# Altium project F4baseband.PrjPcb
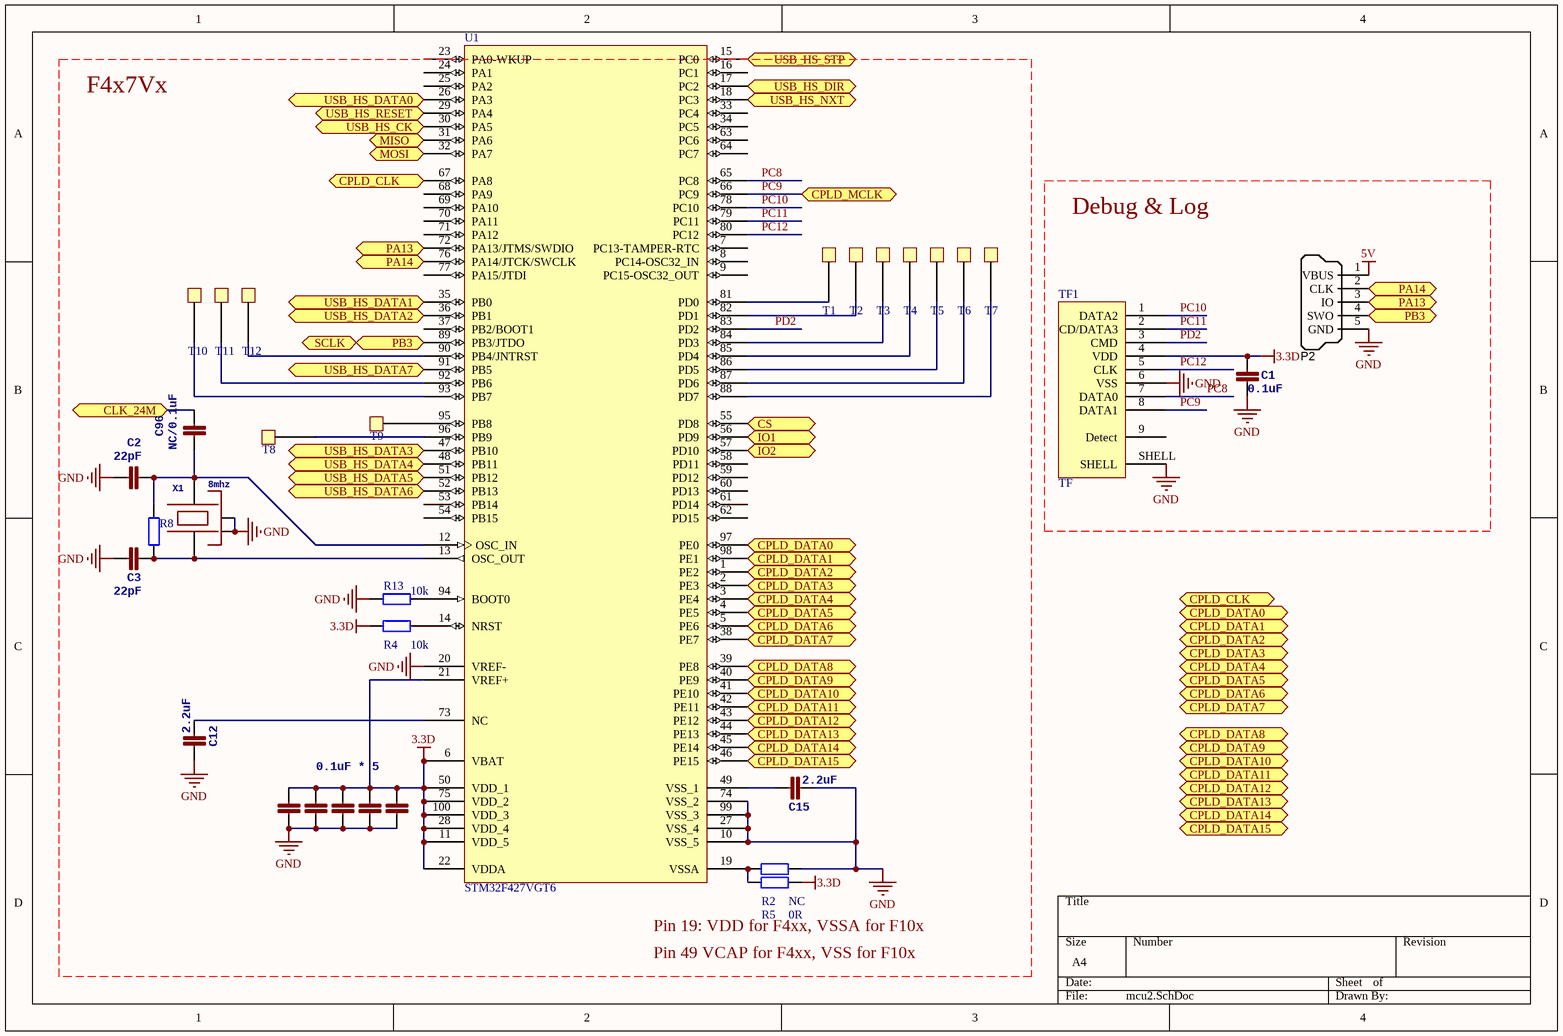
[diagram p0: mcu2.SchDoc]
5 sheets, 212 parts. Net scope: flat (ports and power ports of the same name join across sheets).
Board file: F4baseband.PcbDoc
Sheets:
  mcu2.SchDoc
  CPLD.SchDoc
  power.SchDoc
  ADC.SchDoc
  DAC.SchDoc

## Sheet mcu2.SchDoc
size A4

### Parts
C1  0.1uF  [0402]
C2  22pF  [0402]
C3  22pF  [0402]
C4  0.1uF * 5  [0402]
C5  1n  [0402]  (value not drawn)
C6  1n  [0402]  (value not drawn)
C12  2.2uF  [0603]
C13  1n  [0402]  (value not drawn)
C14  1n  [0402]  (value not drawn)
C15  2.2uF  [0603]
C96  NC/0.1uF  [0402]
P2  SWD_MicroUSB  [MICRO-YZX]  (value not drawn)
R2  0R  [0402]
R4  10k  [0402]
R5  NC  [0402]
R8  (no value)  [0402]
R13  10k  [0402]
T1  TestPad  [TestPad - 1mm]  (value not drawn)
T2  TestPad  [TestPad - 1mm]  (value not drawn)
T3  TestPad  [TestPad - 1mm]  (value not drawn)
T4  TestPad  [TestPad - 1mm]  (value not drawn)
T5  TestPad  [TestPad - 1mm]  (value not drawn)
T6  TestPad  [TestPad - 1mm]  (value not drawn)
T7  TestPad  [TestPad - 1mm]  (value not drawn)
T8  TestPad  [TestPad - 1mm]  (value not drawn)
T9  TestPad  [TestPad - 1mm]  (value not drawn)
T10  TestPad  [TestPad - 1mm]  (value not drawn)
T11  TestPad  [TestPad - 1mm]  (value not drawn)
T12  TestPad  [TestPad - 1mm]  (value not drawn)
TF1  TF  [TF]
U1  STM32F427VGT6  [LQFP100_N]
X1  8mhz  [OSCILLATOR-3.2X2.5]

### Ports
CLK_24M, CPLD_CLK, CPLD_DATA0, CPLD_DATA1, CPLD_DATA2, CPLD_DATA3, CPLD_DATA4, CPLD_DATA5, CPLD_DATA6, CPLD_DATA7, CPLD_DATA8, CPLD_DATA9, CPLD_DATA10, CPLD_DATA11, CPLD_DATA12, CPLD_DATA13, CPLD_DATA14, CPLD_DATA15, CPLD_MCLK, CS, IO1, IO2, MISO, MOSI, PA13, PA14, PB3, SCLK, USB_HS_CK, USB_HS_DATA0, USB_HS_DATA1, USB_HS_DATA2, USB_HS_DATA3, USB_HS_DATA4, USB_HS_DATA5, USB_HS_DATA6, USB_HS_DATA7, USB_HS_DIR, USB_HS_NXT, USB_HS_RESET, USB_HS_STP

### Nets
3.3D: C1.2 C4.2 C5.2 C6.2 C13.2 C14.2 R2.1 R4.2 TF1.4(VDD) U1.6(VBAT) U1.11(VDD_5) U1.21(VREF+) U1.22(VDDA) U1.28(VDD_4) U1.50(VDD_1) U1.75(VDD_2) U1.100(VDD_3)
5V: P2.1(VBUS)
GND: C1.1 C2.2 C3.2 C4.1 C5.1 C6.1 C12.1 C13.1 C14.1 C15.2 P2.5(GND) R5.1 R13.1 TF1.6(VSS) TF1.SHELL U1.10(VSS_5) U1.20(VREF-) U1.27(VSS_4) U1.74(VSS_2) U1.99(VSS_3) X1.2(NC_2) X1.4(NC_4)
PC8: TF1.7(DATA0) U1.65(PC8)
PC9: TF1.8(DATA1) U1.66(PC9) ; port CPLD_MCLK
PC10: TF1.1(DATA2) U1.78(PC10)
PC11: TF1.2(CD/DATA3) U1.79(PC11)
PC12: TF1.5(CLK) U1.80(PC12)
PD2: TF1.3(CMD) U1.83(PD2)
PIN35: U1.97(PE0) ; port CPLD_DATA0
PIN36: U1.98(PE1) ; port CPLD_DATA1
PIN37: U1.1(PE2) ; port CPLD_DATA2
PIN38: U1.2(PE3) ; port CPLD_DATA3
PIN42: U1.67(PA8) ; port CPLD_CLK
PIN43: U1.3(PE4) ; port CPLD_DATA4
PIN44: U1.4(PE5) ; port CPLD_DATA5
PIN45: U1.5(PE6) ; port CPLD_DATA6
PIN46: U1.38(PE7) ; port CPLD_DATA7
PIN47: U1.39(PE8) ; port CPLD_DATA8
PIN48: U1.40(PE9) ; port CPLD_DATA9
PIN49: U1.46(PE15) ; port CPLD_DATA15
PIN50: U1.45(PE14) ; port CPLD_DATA14
PIN51: U1.44(PE13) ; port CPLD_DATA13
PIN52: U1.43(PE12) ; port CPLD_DATA12
PIN53: U1.42(PE11) ; port CPLD_DATA11
PIN54: U1.41(PE10) ; port CPLD_DATA10
PIN58: P2.4(SWO) U1.89(PB3/JTDO) ; port SCLK, port PB3
PIN59: U1.31(PA6) ; port MISO
PIN60: U1.32(PA7) ; port MOSI
PIN61: U1.55(PD8) ; port CS
PIN62: U1.56(PD9) ; port IO1
PIN63: U1.57(PD10) ; port IO2
NetC2_1: C2.1 C96.2 R8.2 U1.12(OSC_IN) X1.3
NetC3_1: C3.1 R8.1 U1.13(OSC_OUT) X1.1
NetC12_2: C12.2 U1.73(NC)
NetC15_1: C15.1 U1.49(VSS_1)
NetC96_1: C96.1 ; port CLK_24M
NetP2_2: P2.2(CLK) U1.76(PA14/JTCK/SWCLK) ; port PA14
NetP2_3: P2.3(IO) U1.72(PA13/JTMS/SWDIO) ; port PA13
NetR2_2: R2.2 R5.2 U1.19(VSSA)
NetR4_1: R4.1 U1.14(NRST)
NetR13_2: R13.2 U1.94(BOOT0)
NetT1_1: T1.1 U1.81(PD0)
NetT2_1: T2.1 U1.82(PD1)
NetT3_1: T3.1 U1.84(PD3)
NetT4_1: T4.1 U1.85(PD4)
NetT5_1: T5.1 U1.86(PD5)
NetT6_1: T6.1 U1.87(PD6)
NetT7_1: T7.1 U1.88(PD7)
NetT8_1: T8.1 U1.96(PB9)
NetT9_1: T9.1 U1.95(PB8)
NetT10_1: T10.1 U1.93(PB7)
NetT11_1: T11.1 U1.92(PB6)
NetT12_1: T12.1 U1.90(PB4/JNTRST)
NetU1_15: U1.15(PC0) ; port USB_HS_STP
NetU1_17: U1.17(PC2) ; port USB_HS_DIR
NetU1_18: U1.18(PC3) ; port USB_HS_NXT
NetU1_26: U1.26(PA3) ; port USB_HS_DATA0
NetU1_29: U1.29(PA4) ; port USB_HS_RESET
NetU1_30: U1.30(PA5) ; port USB_HS_CK
NetU1_35: U1.35(PB0) ; port USB_HS_DATA1
NetU1_36: U1.36(PB1) ; port USB_HS_DATA2
NetU1_47: U1.47(PB10) ; port USB_HS_DATA3
NetU1_48: U1.48(PB11) ; port USB_HS_DATA4
NetU1_51: U1.51(PB12) ; port USB_HS_DATA5
NetU1_52: U1.52(PB13) ; port USB_HS_DATA6
NetU1_91: U1.91(PB5) ; port USB_HS_DATA7

Not connected (* = marked no-connect by the designer): TF1 9(Detect); U1 7(PC13-TAMPER-RTC) 8(PC14-OSC32_IN) 9(PC15-OSC32_OUT) 16(PC1) 23(PA0-WKUP) 24(PA1) 25(PA2) 33(PC4) 34(PC5) 37(PB2/BOOT1) 53(PB14) 54(PB15) 58(PD11) 59(PD12) 60(PD13) 61(PD14) 62(PD15) 63(PC6) 64(PC7) 68(PA9) 69(PA10) 70(PA11) 71(PA12) 77(PA15/JTDI)

### Notes on the sheet
- F4x7Vx
- Debug & Log
- Pin 19: VDD for F4xx, VSSA for F10x
- Pin 49 VCAP for F4xx, VSS for F10x

### Library data of the parts
C1-C6 C12-C15 C96 = CAP0402-CAP: <b>Capacitor</b> / Standard 0603 ceramic capacitor, and 0.1" leaded capacitor.; PARTNO: CC0402ZRY5V7BB104
P2 = SWD_MicroUSB: Connector SMD USB Micro Type B middle mount; Manufacturer 1: Molex Inc; SCDType: undef; Package / Case: SMD; Supplier 1: Digi-Key; Supplier Part Number 1: WM17142CT-ND
R2 R4 R5 R8 R13 = Res2: Resistor; Value: 0Ohm; Published: 8-Jun-2000; LatestRevisionDate: 17-Jul-2002; LatestRevisionNote: Re-released for DXP Platform.; PackageReference: AXIAL-0.4; Publisher: Altium Limited; PackageDescription: Axial Device, Thru-Hole; 2 Leads; 0.4 in Pin Spacing
U1 = STM32F103VBT6: STM32 ARM-based 32-bit MCU with 64 Kbytes Flash, 100-pin LQFP, Industrial Temperature; Published: *; DatasheetVersion: *; PackageVersion: *; PackageReference: *; Publisher: *; PackageDescription: *; ComponentLink1Description: *; ComponentLink1URL: *; ComponentLink2Description: *; ComponentLink2URL: *
X1 = OSCILLATOR-3.2X2.5: Crystal Oscillator in 3.2x2.5 SMD

## Sheet CPLD.SchDoc
size A4
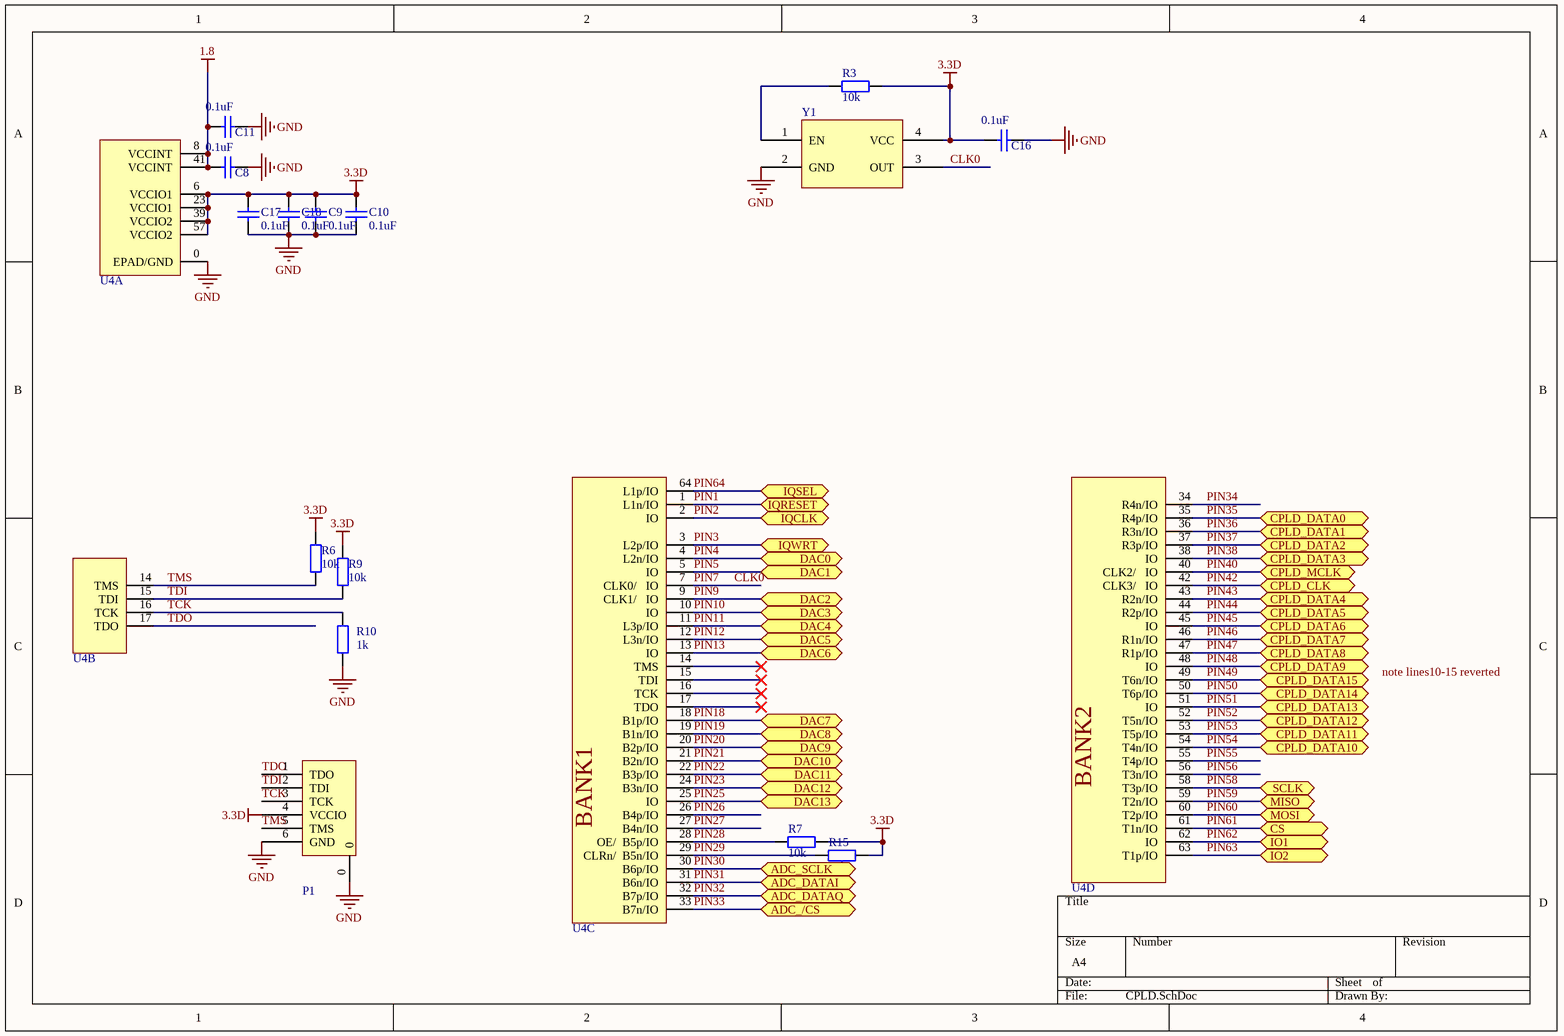
[diagram p1: CPLD.SchDoc]

### Parts
C8  0.1uF  [0402]
C9  0.1uF  [0402]
C10  0.1uF  [0402]
C11  0.1uF  [0402]
C16  0.1uF  [0402]
C17  0.1uF  [0402]
C18  0.1uF  [0402]
P1  JTAG-6P  [GH1.25-6]  (value not drawn)
R3  10k  [0402]
R6  10k  [0402]
R7  10k  [0402]
R9  10k  [0402]
R10  1k  [0402]
R15  10k  [0402]
U4  5M160ZE64  [5M160ZE64]  (value not drawn)  (parts A,B,C,D of 4)
Y1  OSC_50M  [TXC_7Q]  (value not drawn)

### Ports
ADC_/CS, ADC_DATAI, ADC_DATAQ, ADC_SCLK, CPLD_CLK, CPLD_DATA0, CPLD_DATA1, CPLD_DATA2, CPLD_DATA3, CPLD_DATA4, CPLD_DATA5, CPLD_DATA6, CPLD_DATA7, CPLD_DATA8, CPLD_DATA9, CPLD_DATA10, CPLD_DATA11, CPLD_DATA12, CPLD_DATA13, CPLD_DATA14, CPLD_DATA15, CPLD_MCLK, CS, DAC0, DAC1, DAC2, DAC3, DAC4, DAC5, DAC6, DAC7, DAC8, DAC9, DAC10, DAC11, DAC12, DAC13, IO1, IO2, IQCLK, IQRESET, IQSEL, IQWRT, MISO, MOSI, SCLK

### Nets
1.8: C8.2 C11.2 U4.8(VCCINT) U4.41(VCCINT)
3.3D: C9.2 C10.2 C16.2 C17.2 C18.2 P1.4(VCCIO) R3.2 R6.2 R7.2 R9.2 R15.2 U4.6(VCCIO1) U4.23(VCCIO1) U4.39(VCCIO2) U4.57(VCCIO2) Y1.4(VCC)
GND: C8.1 C9.1 C10.1 C11.1 C16.1 C17.1 C18.1 P1.0 P1.6(GND) R10.1 U4.0(EPAD/GND) Y1.2(GND)
CLK0: U4.7(CLK0/___IO) Y1.3(OUT)  [also labelled PIN7]
PIN1: U4.1(L1n/IO) ; port IQRESET
PIN2: U4.2(IO) ; port IQCLK
PIN3: U4.3(L2p/IO) ; port IQWRT
PIN4: U4.4(L2n/IO) ; port DAC0
PIN5: U4.5(IO) ; port DAC1
PIN9: U4.9(CLK1/___IO) ; port DAC2
PIN10: U4.10(IO) ; port DAC3
PIN11: U4.11(L3p/IO) ; port DAC4
PIN12: U4.12(L3n/IO) ; port DAC5
PIN13: U4.13(IO) ; port DAC6
PIN18: U4.18(B1p/IO) ; port DAC7
PIN19: U4.19(B1n/IO) ; port DAC8
PIN20: U4.20(B2p/IO) ; port DAC9
PIN21: U4.21(B2n/IO) ; port DAC10
PIN22: U4.22(B3p/IO) ; port DAC11
PIN23: U4.24(B3n/IO) ; port DAC12
PIN25: U4.25(IO) ; port DAC13
PIN26: U4.26(B4p/IO)
PIN27: U4.27(B4n/IO)
PIN28: R7.1 U4.28(OE/__B5p/IO)
PIN29: R15.1 U4.29(CLRn/__B5n/IO)
PIN30: U4.30(B6p/IO) ; port ADC_SCLK
PIN31: U4.31(B6n/IO) ; port ADC_DATAI
PIN32: U4.32(B7p/IO) ; port ADC_DATAQ
PIN33: U4.33(B7n/IO) ; port ADC_/CS
PIN34: U4.34(R4n/IO)
PIN35: U4.35(R4p/IO) ; port CPLD_DATA0
PIN36: U4.36(R3n/IO) ; port CPLD_DATA1
PIN37: U4.37(R3p/IO) ; port CPLD_DATA2
PIN38: U4.38(IO) ; port CPLD_DATA3
PIN40: U4.40(CLK2/___IO) ; port CPLD_MCLK  [project net PC9]
PIN42: U4.42(CLK3/___IO) ; port CPLD_CLK
PIN43: U4.43(R2n/IO) ; port CPLD_DATA4
PIN44: U4.44(R2p/IO) ; port CPLD_DATA5
PIN45: U4.45(IO) ; port CPLD_DATA6
PIN46: U4.46(R1n/IO) ; port CPLD_DATA7
PIN47: U4.47(R1p/IO) ; port CPLD_DATA8
PIN48: U4.48(IO) ; port CPLD_DATA9
PIN49: U4.49(T6n/IO) ; port CPLD_DATA15
PIN50: U4.50(T6p/IO) ; port CPLD_DATA14
PIN51: U4.51(IO) ; port CPLD_DATA13
PIN52: U4.52(T5n/IO) ; port CPLD_DATA12
PIN53: U4.53(T5p/IO) ; port CPLD_DATA11
PIN54: U4.54(T4n/IO) ; port CPLD_DATA10
PIN55: U4.55(T4p/IO)
PIN56: U4.56(T3n/IO)
PIN58: U4.58(T3p/IO) ; port SCLK
PIN59: U4.59(T2n/IO) ; port MISO
PIN60: U4.60(T2p/IO) ; port MOSI
PIN61: U4.61(T1n/IO) ; port CS
PIN62: U4.62(IO) ; port IO1
PIN63: U4.63(T1p/IO) ; port IO2
PIN64: U4.64(L1p/IO) ; port IQSEL
TCK: P1.3(TCK) R10.2 U4.16(TCK)
TDI: P1.2(TDI) R9.1 U4.15(TDI)
TDO: P1.1(TDO) U4.17(TDO)
TMS: P1.5(TMS) R6.1 U4.14(TMS)
NetR3_1: R3.1 Y1.1(EN)

### Notes on the sheet
- Labels drawn without touching a wire or pin: note lines10-15 reverted
- (in symbol 5M160ZE64, part C) BANK1
- (in symbol 5M160ZE64, part D) BANK2

### Library data of the parts
C8-C11 C16-C18 = Cap: Capacitor; Published: 8-Jun-2000; LatestRevisionDate: 17-Jul-2002; LatestRevisionNote: Re-released for DXP Platform.; PackageReference: RAD-0.3; Publisher: Altium Limited; PackageDescription: Radial Cap, Thru-Hole; 2 Leads; 0.3 in Pin Spacing
R3 R6 R7 R9 R10 R15 = Res2: Resistor; Published: 8-Jun-2000; LatestRevisionDate: 17-Jul-2002; LatestRevisionNote: Re-released for DXP Platform.; PackageReference: AXIAL-0.4; Publisher: Altium Limited; PackageDescription: Axial Device, Thru-Hole; 2 Leads; 0.4 in Pin Spacing

## Sheet power.SchDoc
size A4
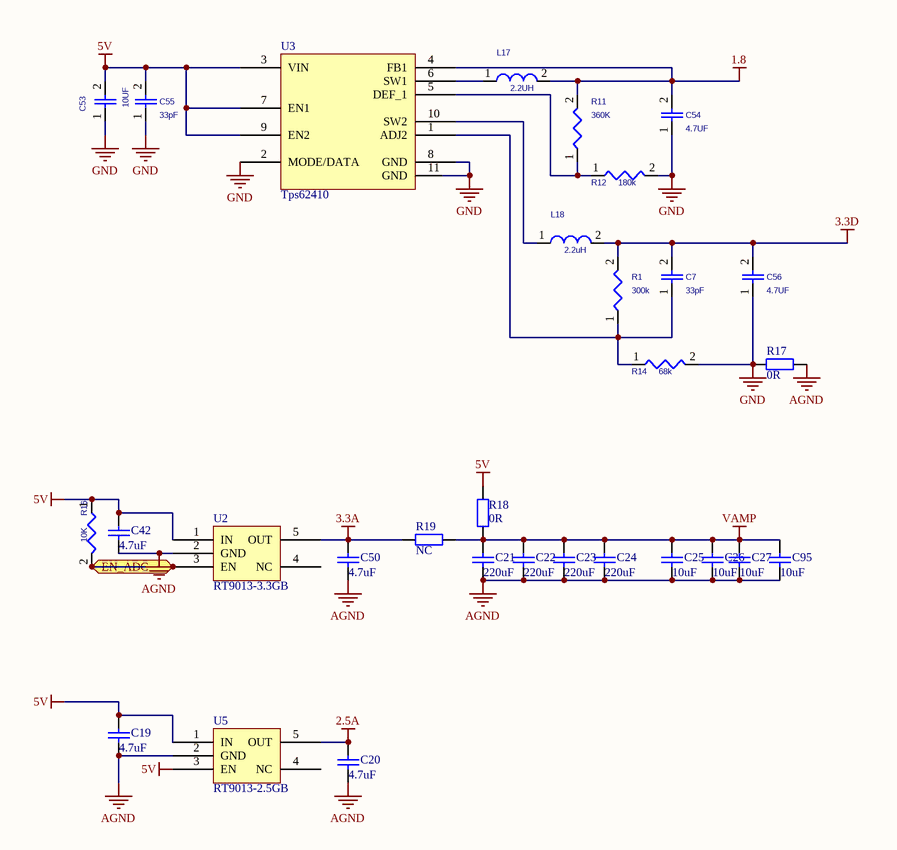
[diagram p2: power.SchDoc]

### Parts
C7  33pF  [0402]
C19  4.7uF  [0603]
C20  4.7uF  [0603]
C21  220uF  [1210]
C22  220uF  [1210]
C23  220uF  [1210]
C24  220uF  [1210]
C25  10uF  [0805]
C26  10uF  [0805]
C27  10uF  [0805]
C42  4.7uF  [0603]
C50  4.7uF  [0603]
C53  10UF  [0805]
C54  4.7UF  [0805]
C55  33pF  [0603]
C56  4.7UF  [0805]
C95  10uF  [0805]
L17  2.2UH  [0806]
L18  2.2uH  [0806]
R1  300k  [0402]
R11  360K  [0402]
R12  180k  [0402]
R14  68k  [0402]
R16  10K  [0402]
R17  0R  [0603]
R18  0R  [0603]
R19  NC  [0603]
U2  RT9013-3.3GB  [SOT23-5]
U3  Tps62410  [DFN-10P-3X3]
U5  RT9013-2.5GB  [SOT23-5]

### Ports
EN_ADC

### Nets
1.8: C54.2 L17.2 R11.2 U3.4(FB1)
2.5A: C20.2 U5.5(OUT)
3.3A: C50.2 R19.1 U2.5(OUT)
3.3D: C7.2 C56.2 L18.2 R1.2
5V: C19.2 C42.2 C53.2 C55.2 R16.1 R18.2 U2.1(IN) U3.3(VIN) U3.7(EN1) U3.9(EN2) U5.1(IN) U5.3(EN)
AGND: C19.1 C20.1 C21.1 C22.1 C23.1 C24.1 C25.1 C26.1 C27.1 C42.1 C50.1 C95.1 R17.1 U2.2(GND) U5.2(GND)
GND: C53.1 C54.1 C55.1 C56.1 R12.2 R14.2 R17.2 U3.2(MODE/DATA) U3.8(GND) U3.11(GND)
VAMP: C21.2 C22.2 C23.2 C24.2 C25.2 C26.2 C27.2 C95.2 R18.1 R19.2
NetC7_1: C7.1 R1.1 R14.1 U3.1(ADJ2)
NetL17_1: L17.1 U3.6(SW1)
NetL18_1: L18.1 U3.10(SW2)
NetR11_1: R11.1 R12.1 U3.5(DEF_1)
NetR16_2: R16.2 U2.3(EN) ; port EN_ADC

Not connected (* = marked no-connect by the designer): U2 4(NC); U5 4(NC)

### Library data of the parts
C7 = CAP/0402: 1st Part Field: 0402
C19-C27 C42 C50 C95 = Cap: Capacitor; Published: 8-Jun-2000; LatestRevisionDate: 17-Jul-2002; LatestRevisionNote: Re-released for DXP Platform.; PackageReference: RAD-0.3; Publisher: Altium Limited; PackageDescription: Radial Cap, Thru-Hole; 2 Leads; 0.3 in Pin Spacing
C53-C56 = CAP/0402: 1st Part Field: 0402
L17 L18 = L/2.5*2.0
R1 R11 R12 R14 R16 = RES/0402_3
R17-R19 = Res2: Resistor; Published: 8-Jun-2000; LatestRevisionDate: 17-Jul-2002; LatestRevisionNote: Re-released for DXP Platform.; PackageReference: AXIAL-0.4; Publisher: Altium Limited; PackageDescription: Axial Device, Thru-Hole; 2 Leads; 0.4 in Pin Spacing
U2 U5 = LP5907

## Sheet ADC.SchDoc
size A4
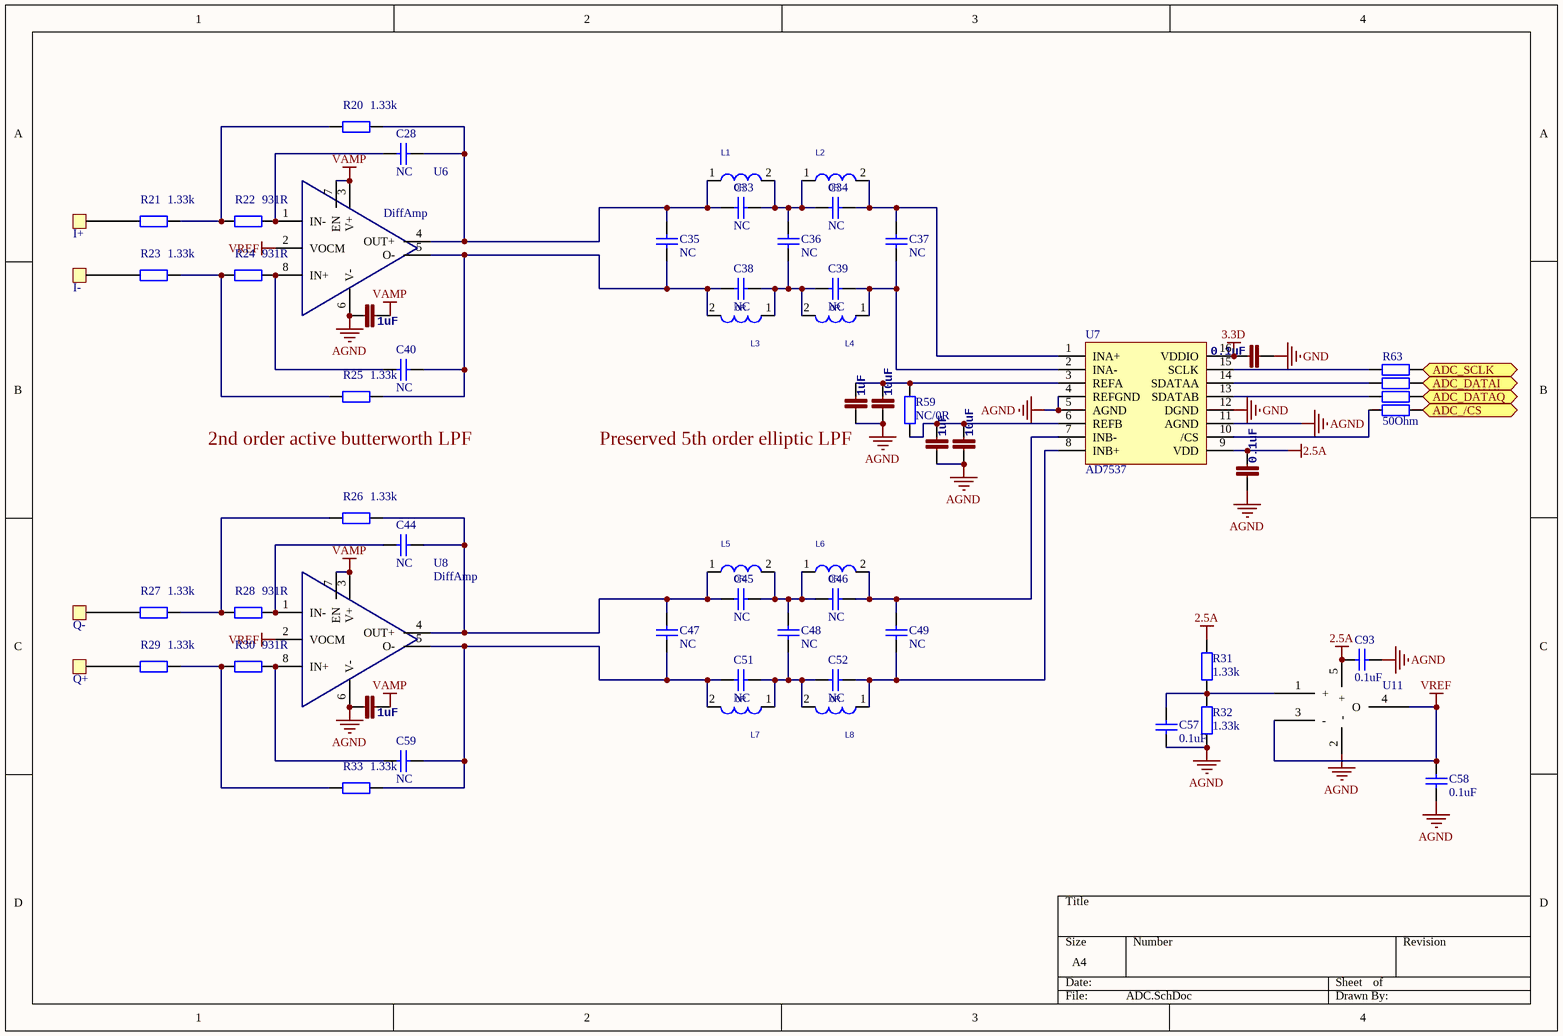
[diagram p3: ADC.SchDoc]

### Parts
C28  NC  [0402]
C29  0.1uF  [0402]
C30  0.1uF  [0603]
C31  10uF  [0603]
C32  1uF  [0805]
C33  NC  [0402]
C34  NC  [0402]
C35  NC  [0402]
C36  NC  [0402]
C37  NC  [0402]
C38  NC  [0402]
C39  NC  [0402]
C40  NC  [0402]
C41  1uF  [0603]
C43  10uF  [0805]
C44  NC  [0402]
C45  NC  [0402]
C46  NC  [0402]
C47  NC  [0402]
C48  NC  [0402]
C49  NC  [0402]
C51  NC  [0402]
C52  NC  [0402]
C57  0.1uF  [0402]
C58  0.1uF  [0402]
C59  NC  [0402]
C89  1uF  [0603]
C90  1uF  [0603]
C93  0.1uF  [0402]
I+  TestPad  [TestPad - 1mm]  (value not drawn)
I-  TestPad  [TestPad - 1mm]  (value not drawn)
L1  0R  [0402]
L2  0R  [0402]
L3  0R  [0402]
L4  0R  [0402]
L5  0R  [0402]
L6  0R  [0402]
L7  0R  [0402]
L8  0R  [0402]
Q+  TestPad  [TestPad - 1mm]  (value not drawn)
Q-  TestPad  [TestPad - 1mm]  (value not drawn)
R20  1.33k  [0402]
R21  1.33k  [0402]
R22  931R  [0402]
R23  1.33k  [0402]
R24  931R  [0402]
R25  1.33k  [0402]
R26  1.33k  [0402]
R27  1.33k  [0402]
R28  931R  [0402]
R29  1.33k  [0402]
R30  931R  [0402]
R31  1.33k  [0402]
R32  1.33k  [0402]
R33  1.33k  [0402]
R59  NC/0R  [0402]
R63  value 50Ohm  [0402X4]  (hidden comment: Res*4)
U6  DiffAmp  [MSOP8/VSSOP8]
U7  AD7537  [AD7357]
U8  DiffAmp  [MSOP8/VSSOP8]
U11  OP-SOT23  [SOT23-5]  (value not drawn)

### Ports
ADC_/CS, ADC_DATAI, ADC_DATAQ, ADC_SCLK

### Nets
2.5A: C30.1 C93.1 R31.1 U7.9(VDD) U11.5(+)
3.3D: C29.1 U7.16(VDDIO)
AGND: C30.2 C31.2 C32.2 C41.2 C43.2 C57.2 C58.2 C89.2 C90.2 C93.2 R32.2 U6.6(V-) U7.4(REFGND) U7.5(AGND) U7.11(AGND) U8.6(V-) U11.2(-)
GND: C29.2 U7.12(DGND)
VAMP: C89.1 C90.1 U6.3(V+) U6.7(EN) U8.3(V+) U8.7(EN)
VREF: C58.1 U6.2(VOCM) U8.2(VOCM) U11.3(-) U11.4(O)
PIN30: R63.4 ; port ADC_SCLK
PIN31: R63.3 ; port ADC_DATAI
PIN32: R63.2 ; port ADC_DATAQ
PIN33: R63.1 ; port ADC_/CS
NetC28_1: C28.1 C33.2 C35.2 L1.1 R20.1 U6.4(OUT+)
NetC28_2: C28.2 R22.1 U6.1(IN-)
NetC31_1: C31.1 C32.1 R59.1 U7.6(REFB)
NetC33_1: C33.1 C34.2 C36.2 L1.2 L2.1
NetC34_1: C34.1 C37.2 L2.2 U7.1(INA+)
NetC35_1: C35.1 C38.1 C40.1 L3.2 R25.1 U6.5(O-)
NetC36_1: C36.1 C38.2 C39.1 L3.1 L4.2
NetC37_1: C37.1 C39.2 L4.1 U7.2(INA-)
NetC40_2: C40.2 R24.1 U6.8(IN+)
NetC41_1: C41.1 C43.1 R59.2 U7.3(REFA)
NetC44_1: C44.1 C45.2 C47.2 L5.1 R26.1 U8.4(OUT+)
NetC44_2: C44.2 R28.1 U8.1(IN-)
NetC45_1: C45.1 C46.2 C48.2 L5.2 L6.1
NetC46_1: C46.1 C49.2 L6.2 U7.7(INB-)
NetC47_1: C47.1 C51.1 C59.1 L7.2 R33.1 U8.5(O-)
NetC48_1: C48.1 C51.2 C52.1 L7.1 L8.2
NetC49_1: C49.1 C52.2 L8.1 U7.8(INB+)
NetC57_1: C57.1 R31.2 R32.1 U11.1(+)
NetC59_2: C59.2 R30.1 U8.8(IN+)
NetI+_1: I+.1 R21.2
NetI-_1: I-.1 R23.2
NetQ+_1: Q+.1 R29.2
NetQ-_1: Q-.1 R27.2
NetR20_2: R20.2 R21.1 R22.2
NetR23_1: R23.1 R24.2 R25.2
NetR26_2: R26.2 R27.1 R28.2
NetR29_1: R29.1 R30.2 R33.2
NetR63_5: R63.5 U7.15(SCLK)
NetR63_6: R63.6 U7.14(SDATAA)
NetR63_7: R63.7 U7.13(SDATAB)
NetR63_8: R63.8 U7.10(/CS)

### Notes on the sheet
- (near R25) 2nd order active butterworth LPF
- (near R59) Preserved 5th order elliptic LPF

### Library data of the parts
C28 C33-C40 C44-C49 C51 C52 C57-C59 C93 = Cap: Capacitor; Published: 8-Jun-2000; LatestRevisionDate: 17-Jul-2002; LatestRevisionNote: Re-released for DXP Platform.; PackageReference: RAD-0.3; Publisher: Altium Limited; PackageDescription: Radial Cap, Thru-Hole; 2 Leads; 0.3 in Pin Spacing
C29-C32 C41 C43 C89 C90 = CAP0402-CAP: as C1 on sheet mcu2
L1-L8 = L/2.5*2.0
R20-R33 R59 = Res2: Resistor; Value: 0Ohm; Published: 8-Jun-2000; LatestRevisionDate: 17-Jul-2002; LatestRevisionNote: Re-released for DXP Platform.; PackageReference: AXIAL-0.4; Publisher: Altium Limited; PackageDescription: Axial Device, Thru-Hole; 2 Leads; 0.4 in Pin Spacing
R63 = Res*4: Resistor; Published: 8-Jun-2000; LatestRevisionDate: 17-Jul-2002; LatestRevisionNote: Re-released for DXP Platform.; PackageReference: AXIAL-0.4; Publisher: Altium Limited; PackageDescription: Axial Device, Thru-Hole; 2 Leads; 0.4 in Pin Spacing

## Sheet DAC.SchDoc
size A4
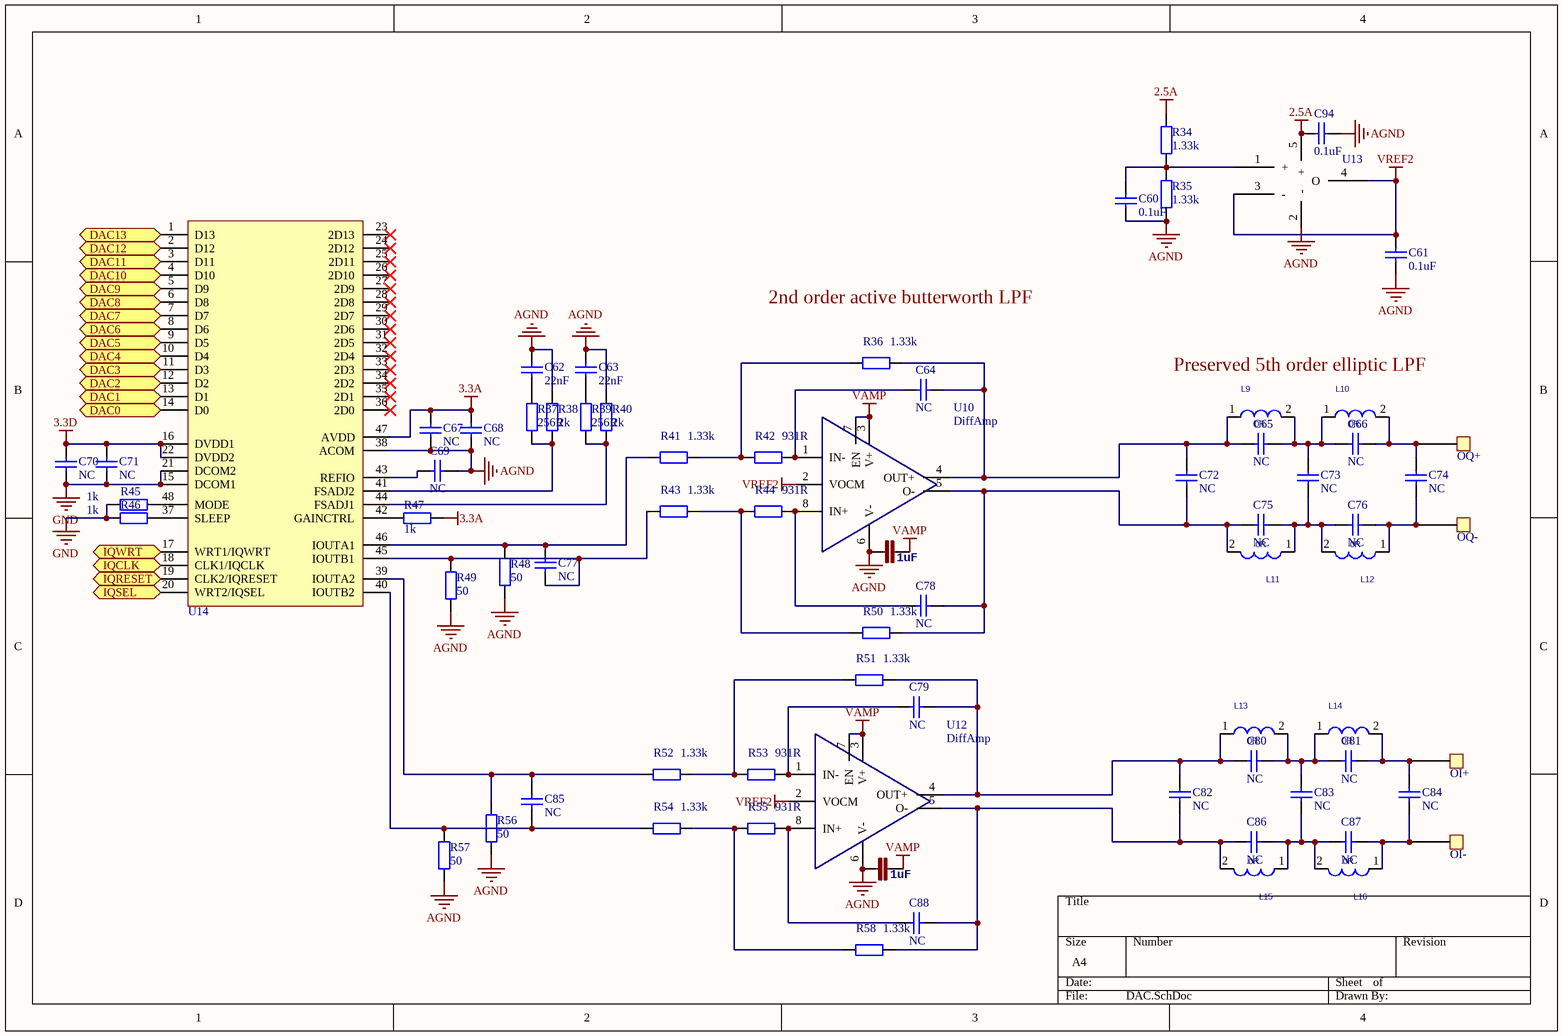
[diagram p4: DAC.SchDoc]

### Parts
C60  0.1uF  [0402]
C61  0.1uF  [0402]
C62  22nF  [0402]
C63  22nF  [0402]
C64  NC  [0402]
C65  NC  [0402]
C66  NC  [0402]
C67  NC  [0603]
C68  NC  [0402]
C69  NC  [0603]
C70  NC  [0402]
C71  NC  [0402]
C72  NC  [0402]
C73  NC  [0402]
C74  NC  [0402]
C75  NC  [0402]
C76  NC  [0402]
C77  NC  [0402]
C78  NC  [0402]
C79  NC  [0402]
C80  NC  [0402]
C81  NC  [0402]
C82  NC  [0402]
C83  NC  [0402]
C84  NC  [0402]
C85  NC  [0402]
C86  NC  [0402]
C87  NC  [0402]
C88  NC  [0402]
C91  1uF  [0603]
C92  1uF  [0603]
C94  0.1uF  [0402]
L9  0R  [0402]
L10  0R  [0402]
L11  0R  [0402]
L12  0R  [0402]
L13  0R  [0402]
L14  0R  [0402]
L15  0R  [0402]
L16  0R  [0402]
OI+  TestPad  [TestPad - 1mm]  (value not drawn)
OI-  TestPad  [TestPad - 1mm]  (value not drawn)
OQ+  TestPad  [TestPad - 1mm]  (value not drawn)
OQ-  TestPad  [TestPad - 1mm]  (value not drawn)
R34  1.33k  [0402]
R35  1.33k  [0402]
R36  1.33k  [0402]
R37  256R  [0402]
R38  2k  [0402]
R39  256R  [0402]
R40  2k  [0402]
R41  1.33k  [0402]
R42  931R  [0402]
R43  1.33k  [0402]
R44  931R  [0402]
R45  1k  [0402]
R46  1k  [0402]
R47  1k  [0402]
R48  50  [0402]
R49  50  [0402]
R50  1.33k  [0402]
R51  1.33k  [0402]
R52  1.33k  [0402]
R53  931R  [0402]
R54  1.33k  [0402]
R55  931R  [0402]
R56  50  [0402]
R57  50  [0402]
R58  1.33k  [0402]
U10  DiffAmp  [MSOP8/VSSOP8]
U12  DiffAmp  [MSOP8/VSSOP8]
U13  OP-SOT23  [SOT23-5]  (value not drawn)
U14  AD9767  [AD9767]  (value not drawn)

### Ports
DAC0, DAC1, DAC2, DAC3, DAC4, DAC5, DAC6, DAC7, DAC8, DAC9, DAC10, DAC11, DAC12, DAC13, IQCLK, IQRESET, IQSEL, IQWRT

### Nets
2.5A: C94.1 R34.1 U13.5(+)
3.3A: C67.1 C68.1 R47.2 U14.47(AVDD)
3.3D: C70.1 C71.1 U14.16(DVDD1) U14.22(DVDD2)
AGND: C60.2 C61.2 C62.1 C63.1 C67.2 C68.2 C69.1 C91.2 C92.2 C94.2 R35.2 R38.2 R40.2 R48.1 R49.2 R56.1 R57.2 U10.6(V-) U12.6(V-) U13.2(-) U14.38(ACOM)
GND: C70.2 C71.2 R45.2 R46.2 U14.15(DCOM1) U14.21(DCOM2)
VAMP: C91.1 C92.1 U10.3(V+) U10.7(EN) U12.3(V+) U12.7(EN)
VREF2: C61.1 U10.2(VOCM) U12.2(VOCM) U13.3(-) U13.4(O)
PIN1: U14.19(CLK2/IQRESET) ; port IQRESET
PIN2: U14.18(CLK1/IQCLK) ; port IQCLK
PIN3: U14.17(WRT1/IQWRT) ; port IQWRT
PIN4: U14.14(D0) ; port DAC0
PIN5: U14.13(D1) ; port DAC1
PIN9: U14.12(D2) ; port DAC2
PIN10: U14.11(D3) ; port DAC3
PIN11: U14.10(D4) ; port DAC4
PIN12: U14.9(D5) ; port DAC5
PIN13: U14.8(D6) ; port DAC6
PIN18: U14.7(D7) ; port DAC7
PIN19: U14.6(D8) ; port DAC8
PIN20: U14.5(D9) ; port DAC9
PIN21: U14.4(D10) ; port DAC10
PIN22: U14.3(D11) ; port DAC11
PIN23: U14.2(D12) ; port DAC12
PIN25: U14.1(D13) ; port DAC13
PIN64: U14.20(WRT2/IQSEL) ; port IQSEL
NetC60_1: C60.1 R34.2 R35.1 U13.1(+)
NetC62_2: C62.2 R37.2
NetC63_2: C63.2 R39.2
NetC64_1: C64.1 C65.2 C72.2 L9.1 R36.1 U10.4(OUT+)
NetC64_2: C64.2 R42.1 U10.1(IN-)
NetC65_1: C65.1 C66.2 C73.2 L9.2 L10.1
NetC66_1: C66.1 C74.2 L10.2 OQ+.1
NetC69_2: C69.2 U14.43(REFIO)
NetC72_1: C72.1 C75.1 C78.1 L11.2 R50.1 U10.5(O-)
NetC73_1: C73.1 C75.2 C76.1 L11.1 L12.2
NetC74_1: C74.1 C76.2 L12.1 OQ-.1
NetC77_1: C77.1 R41.2 R48.2 U14.46(IOUTA1)
NetC77_2: C77.2 R43.2 R49.1 U14.45(IOUTB1)
NetC78_2: C78.2 R44.1 U10.8(IN+)
NetC79_1: C79.1 C80.2 C82.2 L13.1 R51.1 U12.4(OUT+)
NetC79_2: C79.2 R53.1 U12.1(IN-)
NetC80_1: C80.1 C81.2 C83.2 L13.2 L14.1
NetC81_1: C81.1 C84.2 L14.2 OI+.1
NetC82_1: C82.1 C86.1 C88.1 L15.2 R58.1 U12.5(O-)
NetC83_1: C83.1 C86.2 C87.1 L15.1 L16.2
NetC84_1: C84.1 C87.2 L16.1 OI-.1
NetC85_1: C85.1 R52.2 R56.2 U14.39(IOUTA2)
NetC85_2: C85.2 R54.2 R57.1 U14.40(IOUTB2)
NetC88_2: C88.2 R55.1 U12.8(IN+)
NetR36_2: R36.2 R41.1 R42.2
NetR37_1: R37.1 R38.1 U14.41(FSADJ2)
NetR39_1: R39.1 R40.1 U14.44(FSADJ1)
NetR43_1: R43.1 R44.2 R50.2
NetR45_1: R45.1 U14.48(MODE)
NetR46_1: R46.1 U14.37(SLEEP)
NetR47_1: R47.1 U14.42(GAINCTRL)
NetR51_2: R51.2 R52.1 R53.2
NetR54_1: R54.1 R55.2 R58.2

Not connected (* = marked no-connect by the designer): U14 23(2D13)* 24(2D12)* 25(2D11)* 26(2D10)* 27(2D9)* 28(2D8)* 29(2D7)* 30(2D6)* 31(2D5)* 32(2D4)* 33(2D3)* 34(2D2)* 35(2D1)* 36(2D0)*

### Notes on the sheet
- 2nd order active butterworth LPF
- Preserved 5th order elliptic LPF

### Library data of the parts
C60-C88 C94 = Cap: Capacitor; Published: 8-Jun-2000; LatestRevisionDate: 17-Jul-2002; LatestRevisionNote: Re-released for DXP Platform.; PackageReference: RAD-0.3; Publisher: Altium Limited; PackageDescription: Radial Cap, Thru-Hole; 2 Leads; 0.3 in Pin Spacing
C91 C92 = CAP0402-CAP: as C1 on sheet mcu2
L9-L16 = L/2.5*2.0
R34-R58 = Res2: Resistor; Value: 0Ohm; Published: 8-Jun-2000; LatestRevisionDate: 17-Jul-2002; LatestRevisionNote: Re-released for DXP Platform.; PackageReference: AXIAL-0.4; Publisher: Altium Limited; PackageDescription: Axial Device, Thru-Hole; 2 Leads; 0.4 in Pin Spacing

## Nets that join several sheets
1.8: CPLD (C8.2 C11.2 U4.8 U4.41), power (C54.2 L17.2 R11.2 U3.4)
2.5A: power (C20.2 U5.5), ADC (5 pins), DAC (C94.1 R34.1 U13.5)
3.3A: power (C50.2 R19.1 U2.5), DAC (C67.1 C68.1 R47.2 U14.47)
3.3D: mcu2 (17 pins), CPLD (16 pins), power (C7.2 C56.2 L18.2 R1.2), ADC (C29.1 U7.16), DAC (C70.1 C71.1 U14.16 U14.22)
5V: mcu2 (P2.1), power (12 pins)
AGND: power (15 pins), ADC (17 pins), DAC (21 pins)
GND: mcu2 (22 pins), CPLD (12 pins), power (10 pins), ADC (C29.2 U7.12), DAC (6 pins)
VAMP: power (10 pins), ADC (6 pins), DAC (6 pins)
PC9: mcu2 (TF1.8 U1.66), CPLD (U4.40)
PIN1: CPLD (U4.1), DAC (U14.19)
PIN2: CPLD (U4.2), DAC (U14.18)
PIN3: CPLD (U4.3), DAC (U14.17)
PIN4: CPLD (U4.4), DAC (U14.14)
PIN5: CPLD (U4.5), DAC (U14.13)
PIN9: CPLD (U4.9), DAC (U14.12)
PIN10: CPLD (U4.10), DAC (U14.11)
PIN11: CPLD (U4.11), DAC (U14.10)
PIN12: CPLD (U4.12), DAC (U14.9)
PIN13: CPLD (U4.13), DAC (U14.8)
PIN18: CPLD (U4.18), DAC (U14.7)
PIN19: CPLD (U4.19), DAC (U14.6)
PIN20: CPLD (U4.20), DAC (U14.5)
PIN21: CPLD (U4.21), DAC (U14.4)
PIN22: CPLD (U4.22), DAC (U14.3)
PIN23: CPLD (U4.24), DAC (U14.2)
PIN25: CPLD (U4.25), DAC (U14.1)
PIN30: CPLD (U4.30), ADC (R63.4)
PIN31: CPLD (U4.31), ADC (R63.3)
PIN32: CPLD (U4.32), ADC (R63.2)
PIN33: CPLD (U4.33), ADC (R63.1)
PIN35: mcu2 (U1.97), CPLD (U4.35)
PIN36: mcu2 (U1.98), CPLD (U4.36)
PIN37: mcu2 (U1.1), CPLD (U4.37)
PIN38: mcu2 (U1.2), CPLD (U4.38)
PIN42: mcu2 (U1.67), CPLD (U4.42)
PIN43: mcu2 (U1.3), CPLD (U4.43)
PIN44: mcu2 (U1.4), CPLD (U4.44)
PIN45: mcu2 (U1.5), CPLD (U4.45)
PIN46: mcu2 (U1.38), CPLD (U4.46)
PIN47: mcu2 (U1.39), CPLD (U4.47)
PIN48: mcu2 (U1.40), CPLD (U4.48)
PIN49: mcu2 (U1.46), CPLD (U4.49)
PIN50: mcu2 (U1.45), CPLD (U4.50)
PIN51: mcu2 (U1.44), CPLD (U4.51)
PIN52: mcu2 (U1.43), CPLD (U4.52)
PIN53: mcu2 (U1.42), CPLD (U4.53)
PIN54: mcu2 (U1.41), CPLD (U4.54)
PIN58: mcu2 (P2.4 U1.89), CPLD (U4.58)
PIN59: mcu2 (U1.31), CPLD (U4.59)
PIN60: mcu2 (U1.32), CPLD (U4.60)
PIN61: mcu2 (U1.55), CPLD (U4.61)
PIN62: mcu2 (U1.56), CPLD (U4.62)
PIN63: mcu2 (U1.57), CPLD (U4.63)
PIN64: CPLD (U4.64), DAC (U14.20)